# EAGLE design untitled (EAGLE 5.09)
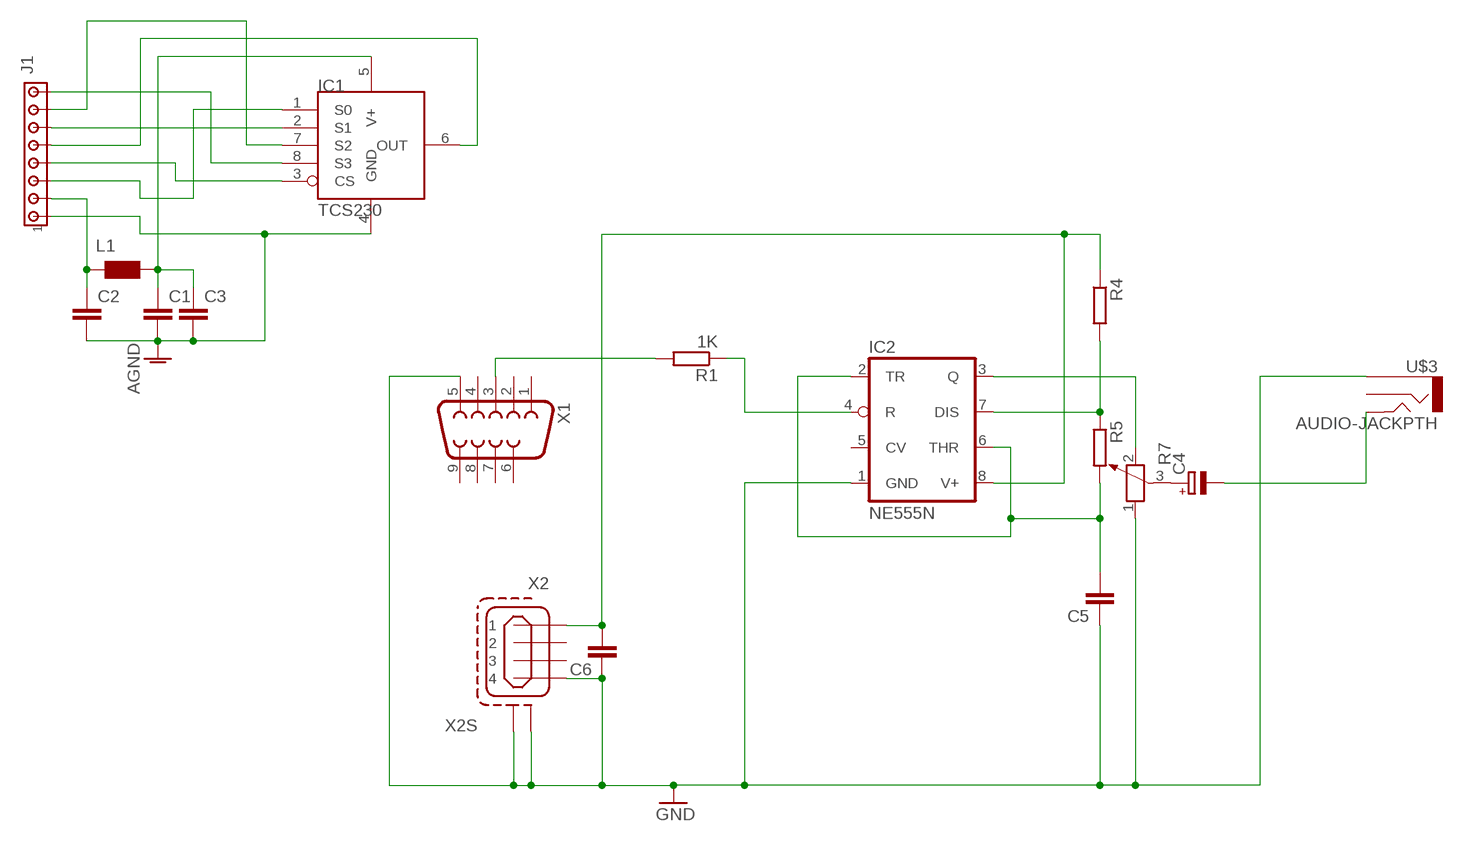
[diagram p0: schematic, sheet 1]

## Parts
C1  C-EUC0805  [C0805]
C2  C-EUC0805  [C0805]
C3  C-EUC0805  [C0805]
C4  CPOL-EUE2.5-5  [E2,5-5]
C5  C-EU050-035X075  [C050-035X075]
C6  C-EU050-035X075  [C050-035X075]
IC1  TCS230  [SO08]
IC2  NE555N  [DIL08]
J1  MTA08-100  [10X08MTA]
L1  WE-CBF_1806  [1806]
R1  1K  R-EU_0207/10  [0207/10]
R4  R-EU_0207/10  [0207/10]
R5  R-EU_0207/10  [0207/10]
R7  POTENTIOMETER_PT-10  [PT-10]
U$3  AUDIO-JACKPTH  [AUDIO-JACK]
X1  DB9  [DB9]
X2  MINI-USB_SHIELD4P-85-32004-10X  [85-32004-10X]

## Nets
AGND: C1.2 C2.2 C3.2 IC1.4(GND) J1.1
GND: C5.1 C6.1 IC2.1(GND) R7.1 U$3.1 X1.5 X2.4 X2.M1(S1) X2.M2(S2)
N$1: IC1.3(CS) J1.4
N$2: IC1.2(S1) J1.6
N$3: IC1.1(S0) J1.3
N$4: C6.2 IC2.8(V+) R4.1 X2.1
N$5: C1.1 C3.1 IC1.5(V+) L1.2
N$6: IC1.6(OUT) J1.5
N$7: IC1.8(S3) J1.8
N$8: IC1.7(S2) J1.7
N$9: C2.1 J1.2 L1.1
N$10: C4.- U$3.5
N$11: IC2.4(R) R1.1
N$12: IC2.3(Q) R7.2
N$13: C4.+ R7.3
N$14: IC2.7(DIS) R4.2 R5.1
N$15: R1.2 X1.3
N$16: C5.2 IC2.2(TR) IC2.6(THR) R5.2
Unconnected: IC2.5(CV) U$3.2 X1.1 X1.2 X1.4 X1.6 X1.7 X1.8 X1.9 X2.2 X2.3

## Library data of the parts
C1-C3 C5 C6 = rcl:C-EU: CAPACITOR, European symbol
C4 = rcl:CPOL-EU: POLARIZED CAPACITOR, European symbol
IC1 = Mine:TCS230: TAOS Light to Frequency RGBW
IC2 = linear:*555: TIMER
J1 = con-amp:MTA08-100: AMP connector
L1 = wuerth-elektronik:WE-CBF: SMD EMI Suppression Ferrite Beads - excellent anti-EMI properties - low DCR - impedances till 3000 ohms - rated current up to 6 A
R1 R4 R5 = rcl:R-EU_: RESISTOR, European symbol
R7 = rcl:POTENTIOMETER_: Potentiometer
U$3 = SparkFun:AUDIO-JACK: 3.5mm Audio Jack Simple 3.5mm common PCB mount audio jack. SKU: PRT-08032
X1 = SparkFun:DB9: DB9 Connector Standard DB9 (D-Sub 9) serial connector. Can be used for CAN bus as well as RS485 and RS232. Footprint production proven. Spark Fun Electronics SKU : PRT-00429
X2 = con-cypressindustries:MINI-USB_SHIELD4P-: MINI USB 4 Pol. Source: www.cypressindustries.com

## Board
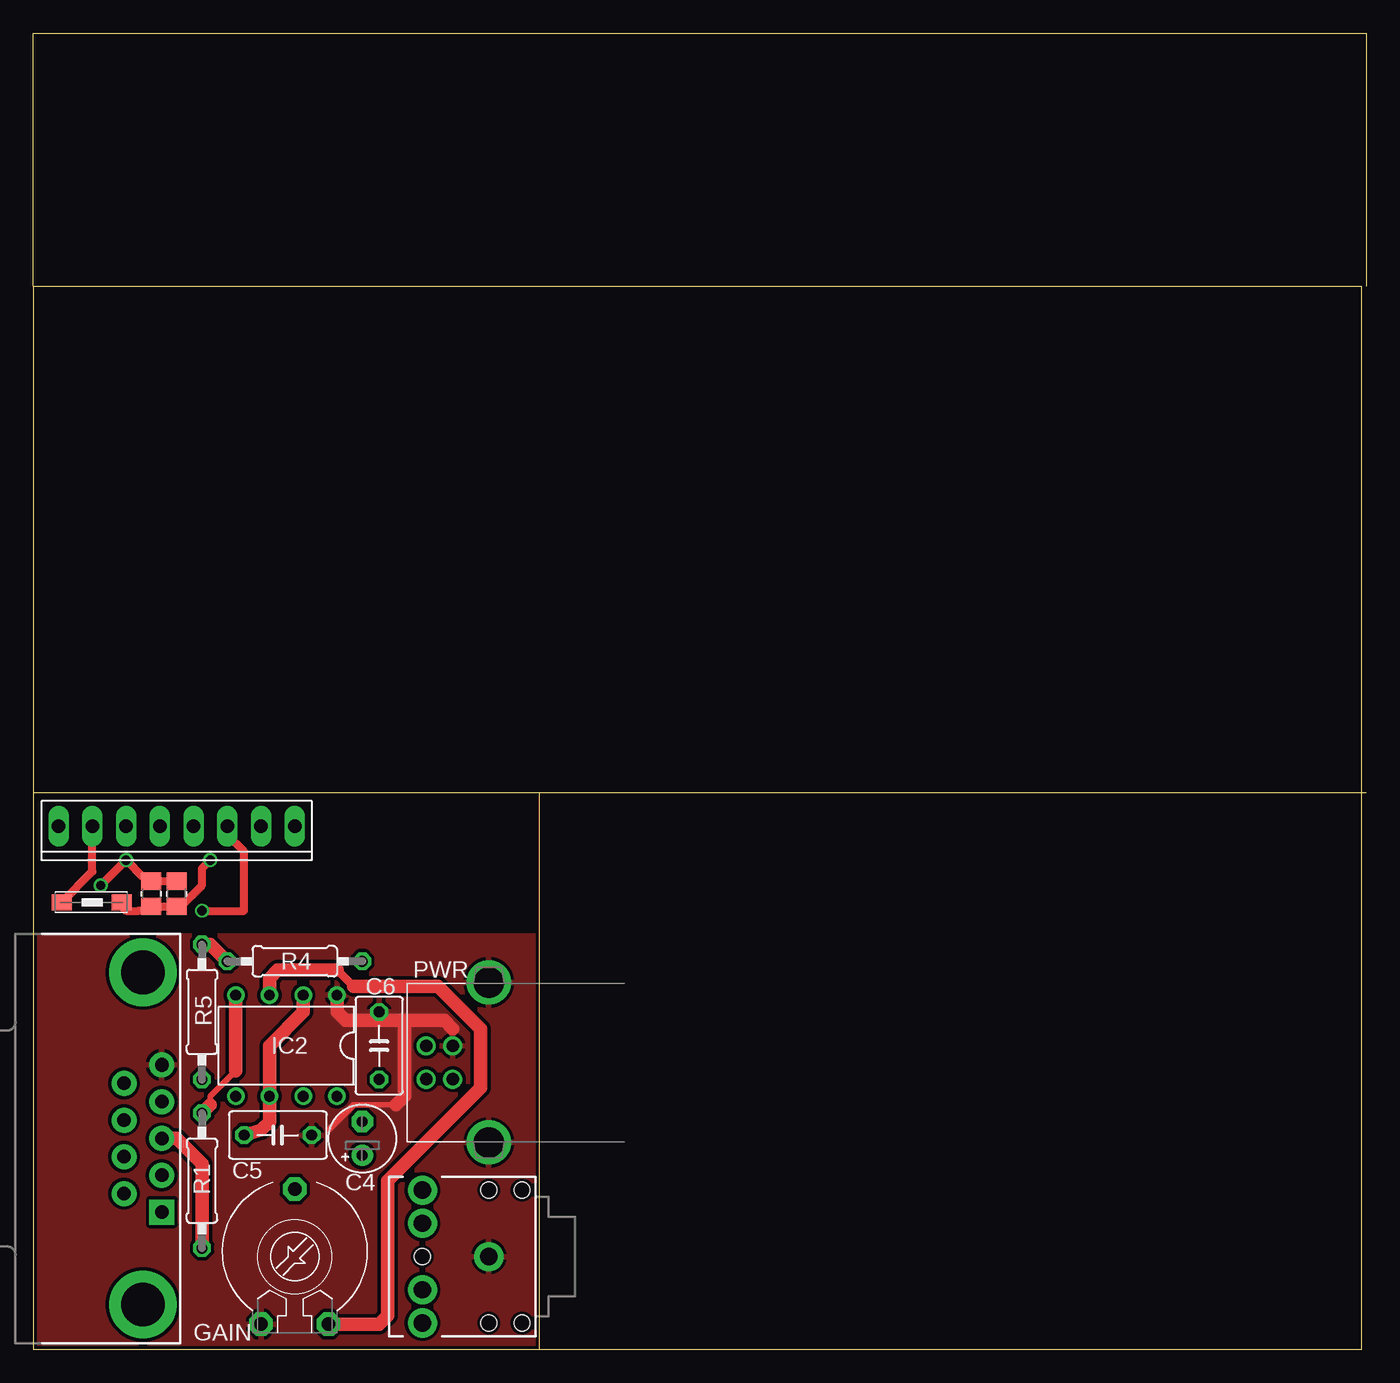
[diagram p1: board, top side]
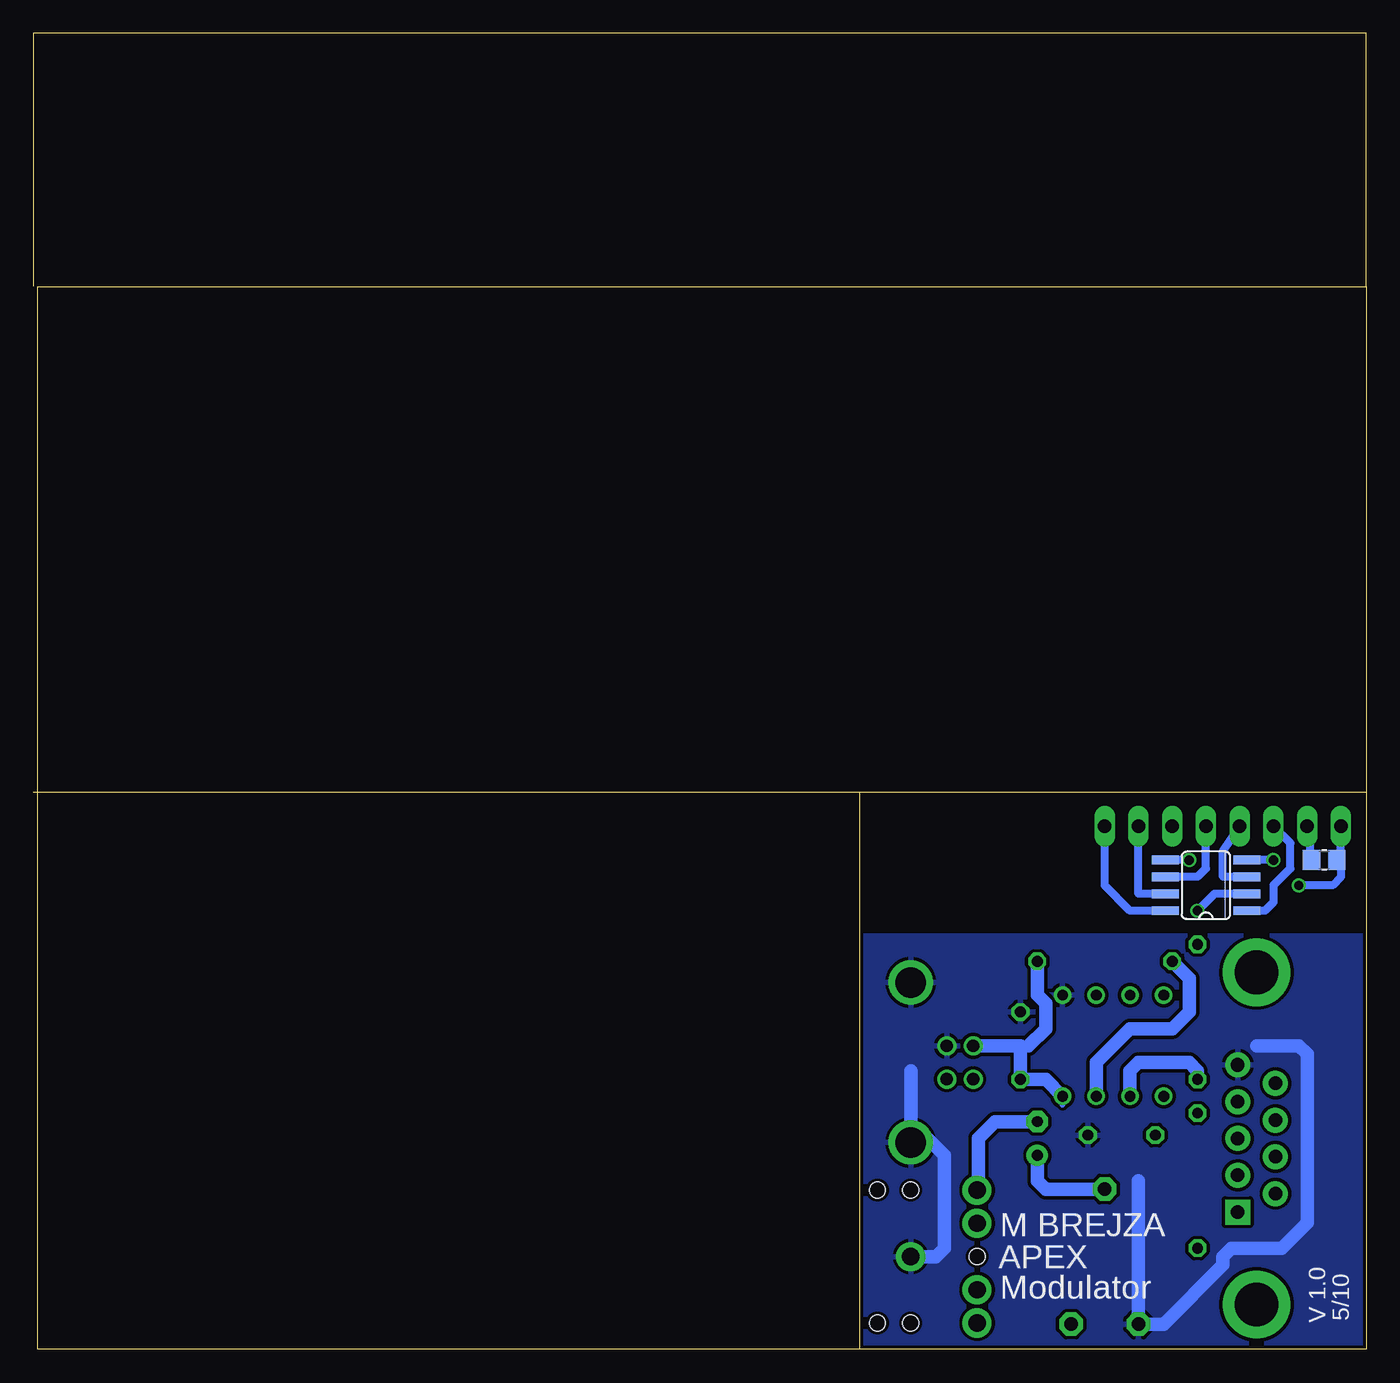
[diagram p2: board, bottom side, seen from below]

Size 100.33 x 99.06 mm. Coordinates in mm from the lower left corner, seen from the top.
Outline: 38.1,0 0,0 0,41.91
Outline: 38.1,0 100,0 100,80 0,80 0,41.91
Outline: 0,41.91 38.1,41.91
Outline: 38.1,41.91 100.33,41.91
Outline: 38.1,0 38.1,41.91
Outline: 0,80.01 0,99.06 100.33,99.06 100.33,80.01
Copper layers (1*16): Top 0.035mm / dielectric 1.5mm / Bottom 0.035mm
Design rules "Fusion_eagle_rule_v1.1": minimum track width 6mil, minimum drill 12mil, track to track 6mil, track to pad 6mil, pad to pad 6mil, via to via 6mil, smd to smd 0mil, copper to edge 10mil, drill to drill 10mil, minimum pad ring 10mil, minimum via ring 6mil, stop-mask expansion 2mil, vias tented up to drill 100mil, thermal gap 10mil

### Footprints (pad centres in the part's own frame; a part is rotated, then mirrored left to right if it is on the bottom)
C0805 = smd 1.3 x 1.5: 1 -0.95,0; 2 0.95,0
E2,5-5 = drill 0.813 pad 1.6 round: + -1.27,0 | drill 0.813 pad 1.6 octagon: - 1.27,0
C050-035X075 = drill 0.813 octagon: 1 -2.54,0; 2 2.54,0
SO08 = smd 0.66 x 2.032: 1 -1.905,-3.073; 2 -0.635,-3.073; 3 0.635,-3.073; 4 1.905,-3.073; 5 1.905,3.073; 6 0.635,3.073; 7 -0.635,3.073; 8 -1.905,3.073
DIL08 = drill 0.813 pad 1.27 round: 1 -3.81,-3.81; 2 -1.27,-3.81; 3 1.27,-3.81; 4 3.81,-3.81; 5 3.81,3.81; 6 1.27,3.81; 7 -1.27,3.81; 8 -3.81,3.81
10X08MTA = drill 1.016 long: 1 8.89,0; 2 6.35,0; 3 3.81,0; 4 1.27,0; 5 -1.27,0; 6 -3.81,0; 7 -6.35,0; 8 -8.89,0
1806 = smd 1.5 x 1.2: 1 -2.3,0; 2 2.2,0
0207/10 = drill 0.813 octagon: 1 -5.08,0; 2 5.08,0
PT-10 = drill 1.016 pad 1.778 octagon: 1 -2.54,-5.08; 2 2.54,-5.08; 3 0,5.08
AUDIO-JACK = drill 1.3 pad 2.184 round: 1 0,0; 2 5,5; 3 5,2.5; 4 5,-2.5; 5 5,-5 | hole 1.2: 0,5; -2.5,5; -2.5,-5; 0,-5; 5,0
DB9 = drill 1.016 pad 1.88 square: 1 -5.54,-1.42 | drill 1.016 pad 1.88 round: 2 -2.77,-1.42; 3 0,-1.42; 4 2.77,-1.42; 5 5.54,-1.42; 6 -4.15,1.42; 7 -1.38,1.42; 8 1.38,1.42; 9 4.15,1.42 | drill 3.302 pad 5.08 round: G1 -12.5,0; G2 12.5,0
85-32004-10X = drill 0.92 pad 1.27 round: 1 4.71,-1.25; 2 4.71,1.25; 3 2.71,1.25; 4 2.71,-1.25 | drill 2.3 pad 3 round: M1 0,6.02; M2 0,-6.02

### Placement (x,y rotation side)
C1  10.79,34.29 90 top
C2  3.17,36.83 0 bottom
C3  8.89,34.29 90 top
C4  24.77,15.88 90 top
C5  18.41,16.13 180 top
C6  26.04,22.86 270 top
IC1  12.06,34.92 90 bottom
IC2  19.05,22.86 180 top
J1  10.79,39.37 180 top
L1  4.45,33.66 0 top
R1  12.7,12.7 270 top
R4  19.68,29.21 180 top
R5  12.7,25.4 270 top
R7  19.68,6.99 0 top
U$3  34.29,6.99 180 top
X1  8.26,15.88 90 top
X2  34.29,21.59 180 top

### Tracks (layer width: path | path; a pad name or v marks a point on that pad's centre or on a via)
AGND  (via drill 0.7)
  Top 0.61: v5.08,34.92 v6.99,36.83 8.26,35.56 C3.2 C1.2
  Bottom 0.61: v6.99,36.83 IC1.4 | J1.1 1.91,36.83 C2.2 1.91,36.51 1.91,35.56 2.54,34.92 v5.08,34.92
GND
  Top 0.406: R7.1 16.51,1.91 | 22.23,16.51 24.13,18.41 27.3,18.41
  Top 1.016: IC2.1 22.86,25.4 23.5,24.77 26.04,24.77 | 27.94,24.77 30.95,24.77 31.58,24.13 | 27.94,24.77 26.04,24.77 | 26.04,24.77 C6.1 | 27.3,18.41 27.94,19.05 27.94,24.77
  Bottom 0.406: X2.4 31.6,22.86 | 33.98,15.88 X2.M1
  Bottom 1.016: X2.M1 34.29,20.95 | U$3.1 32.38,6.99 31.75,7.62 31.75,14.61 33.02,15.88 33.98,15.88 | 8.23,22.86 5.08,22.86 4.45,22.23 4.45,9.53 6.35,7.62 10.16,7.62 10.79,6.99 10.79,6.35 15.24,1.91 R7.1 17.14,12.7
  pour Bottom (isolate 0.254): 0,31.11 38.1,31.11 38.1,0 0,0
  pour Top (isolate 0.254): 0,31.11 38.1,31.11 38.1,0 0,0
N$1
  Bottom 0.61: J1.4 10.79,37.47 10.79,35.56 IC1.3
N$2  (via drill 0.7)
  Top 0.61: J1.6 14.61,38.73 15.88,37.47 15.88,33.02 v12.7,33.02
  Bottom 0.61: v12.7,33.02 11.43,34.29 IC1.2
N$3
  Bottom 0.61: IC1.1 7.62,33.02 6.99,33.66 6.99,34.92 5.71,36.2 5.71,38.1 J1.3
N$4
  Bottom 0.406: 26.04,22.84 25.42,22.84 | IC2.8 22.86,18.41
  Bottom 1.016: X2.1 26.04,22.84 C6.2 24.13,20.32 IC2.8 | 25.42,22.84 24.13,24.13 24.13,26.04 24.77,26.67 R4.1
N$5  (via drill 0.7)
  Top 0.61: v13.34,36.83 12.7,36.2 12.7,34.92 11.12,33.34 C1.1 C3.1 7.93,33.02 6.99,33.02 6.35,33.66 L1.2
  Bottom 0.61: v13.34,36.83 IC1.5
N$6
  Bottom 0.61: IC1.6 12.7,35.56 12.06,36.2 J1.5
N$7
  Bottom 0.61: IC1.8 17.78,33.02 19.68,34.92 J1.8
N$8
  Bottom 0.61: J1.7 17.14,34.29 IC1.7
N$9
  Top 0.61: J1.2 4.45,35.95 L1.1
  Bottom 0.61: J1.2 4.25,39.17 4.25,36.83 | 4.25,36.83 C2.1 | 4.25,36.83 4.45,36.83
N$10
  Bottom 0.406: 29.21,12.06 U$3.5
  Bottom 1.016: C4.- 27.94,17.14 29.21,15.88 29.21,12.06
N$11
  Top 0.406: 15.24,20.95 13.34,19.05 13.34,18.41
  Top 1.016: 15.24,20.95 IC2.4 | R1.1 13.34,18.41
N$12
  Top 0.61: 24.13,27.3 22.86,28.57
  Top 1.016: 24.13,27.3 30.48,27.3 33.66,24.13 33.66,19.68 26.67,12.7 26.67,2.54 26.04,1.91 R7.2 | 22.86,28.57 18.41,28.57 17.78,27.94 IC2.3
N$13
  Bottom 1.016: C4.+ 24.77,12.7 24.13,12.06 R7.3
N$14
  Top 1.016: R5.1 13.34,30.48 R4.2
  Bottom 1.016: R4.2 13.34,27.94 13.34,25.4 14.61,24.13 17.78,24.13 20.32,21.59 IC2.7
N$15
  Top 1.016: X1.3 10.79,15.88 12.7,13.97 R1.2
N$16
  Top 1.016: IC2.2 20.32,25.4 17.78,22.86 IC2.6 17.78,17.14 17.14,16.51 C5.2
  Bottom 1.016: R5.2 12.7,20.95 13.34,21.59 17.14,21.59 17.78,20.95 IC2.6

### Text on the board
tPlace: PWR
_tsilk: GAIN
_bsilk: M BREJZA | 5/10 | V 1.0 | APEX | Modulator